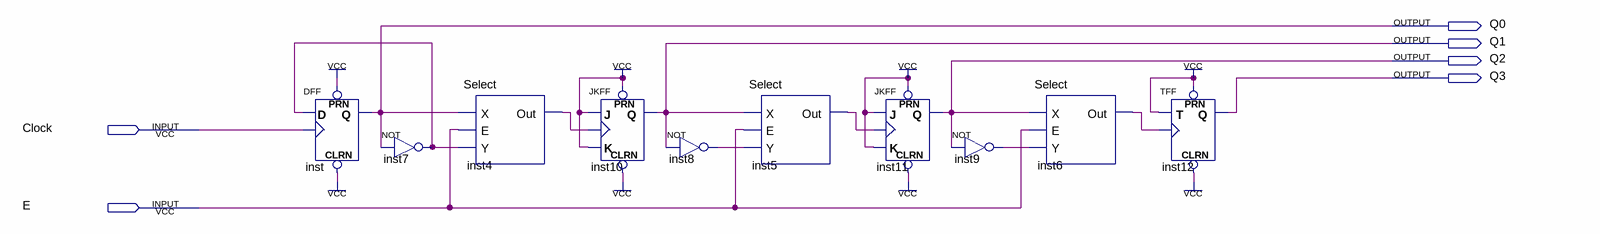
[diagram p0: schematic sheet]
// Quartus schematic Pratica.bdf as structural Verilog: 10 symbols, 6 pins
module Pratica (
  input  Clock,
  input  E,
  output Q0,
  output Q1,
  output Q2,
  output Q3
);

  wire inst4_out, inst5_out, inst6_out, inst7_out, inst8_out, inst9_out;

  DFF inst (.CLRN(1'b1), .CLK(Clock), .D(inst7_out), .PRN(1'b1), .Q(Q0));
  not inst7 (inst7_out, Q0);
  Select inst4 (.X(Q0), .E(E), .Y(inst7_out), .Out(inst4_out));
  JKFF inst10 (.PRN(1'b1), .CLRN(1'b1), .K(1'b1), .J(1'b1), .CLK(inst4_out), .Q(Q1));
  not inst8 (inst8_out, Q1);
  Select inst5 (.X(Q1), .E(E), .Y(inst8_out), .Out(inst5_out));
  JKFF inst11 (.PRN(1'b1), .CLRN(1'b1), .K(1'b1), .J(1'b1), .CLK(inst5_out), .Q(Q2));
  not inst9 (inst9_out, Q2);
  Select inst6 (.X(Q2), .E(E), .Y(inst9_out), .Out(inst6_out));
  TFF inst12 (.PRN(1'b1), .CLRN(1'b1), .T(1'b1), .CLK(inst6_out), .Q(Q3));
endmodule
